# EAGLE schematic PowerMeter (EAGLE 7.2.0)
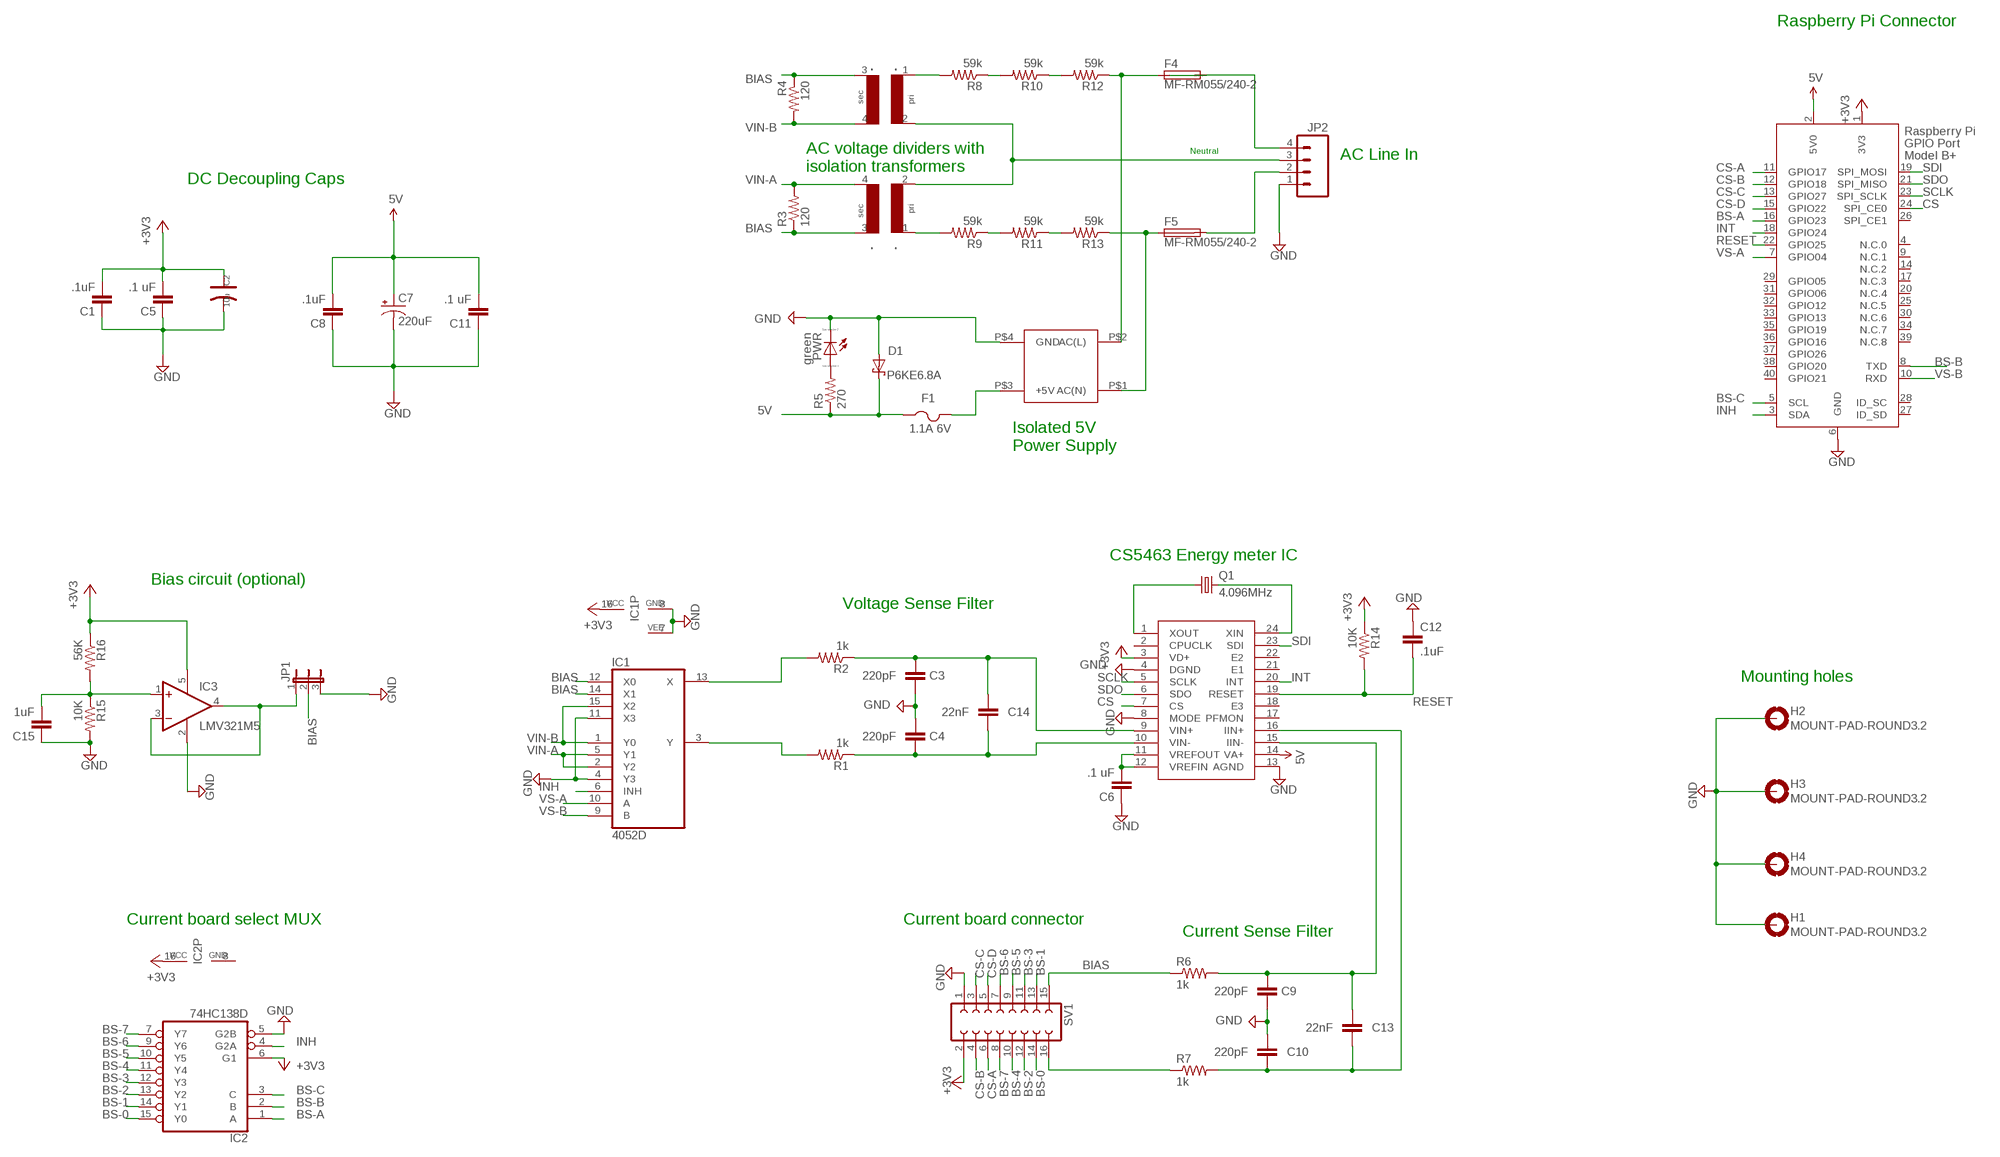
[diagram p0: schematic, sheet 1]

## Parts
C1  .1uF  C-EUC1206  [C1206]
C2  10u  CAP-AVX-C  [AVX-C]
C3  220pF  C-EUC1206  [C1206]
C4  220pF  C-EUC1206  [C1206]
C5  .1 uF  C-EUC1206  [C1206]
C6  .1 uF  C-EUC1206  [C1206]
C7  220uF  CPOL-USE2,5-6E  [E2,5-6E]
C8  .1uF  C-EUC1206  [C1206]
C9  220pF  C-EUC1206  [C1206]
C10  220pF  C-EUC1206  [C1206]
C11  .1 uF  C-EUC1206  [C1206]
C12  .1uF  C-EUC1206  [C1206]
C13  22nF  C-EUC1206  [C1206]
C14  22nF  C-EUC1206  [C1206]
C15  1uF  C-EUC1206  [C1206]
D1  P6KE6.8A  P6KEXXA  [C1702-15]
F1  1.1A 6V  PTCFUSE-1812  [1812]
F4  MF-RM055/240-2  FUSETE5  [TE5]
F5  MF-RM055/240-2  FUSETE5  [TE5]
H1  MOUNT-PAD-ROUND3.2  [3,2-PAD]
H2  MOUNT-PAD-ROUND3.2  [3,2-PAD]
H3  MOUNT-PAD-ROUND3.2  [3,2-PAD]
H4  MOUNT-PAD-ROUND3.2  [3,2-PAD]
IC1  4052D  [SO16]
IC2  74HC138D  [SO16]
IC3  LMV321M5  [SOT23-5]
JP1  JP2E  [JP2]
JP2  M04SCREW  [SCREWTERMINAL-3.5MM-4]
PWR  green  LED_E  [LED_1206]
Q1  4.096MHz  CRYSTALHC49S  [HC49/S]
R1  1k  R-US_R1206  [R1206]
R2  1k  R-US_R1206  [R1206]
R3  120  R-US_R1206  [R1206]
R4  120  R-US_R1206  [R1206]
R5  270  R-US_R1206  [R1206]
R6  1k  R-US_R1206  [R1206]
R7  1k  R-US_R1206  [R1206]
R8  59k  R-US_R1206  [R1206]
R9  59k  R-US_R1206  [R1206]
R10  59k  R-US_R1206  [R1206]
R11  59k  R-US_R1206  [R1206]
R12  59k  R-US_R1206  [R1206]
R13  59k  R-US_R1206  [R1206]
R14  10K  R-US_R1206  [R1206]
R15  10K  R-US_R1206  [R1206]
R16  56K  R-US_R1206  [R1206]
SV1  FE08-2  [FE08-2]
U$2  TV16E  [TV16E]
U$3  TV16E  [TV16E]
U$4  VSK-S10  [VSK-S10]
U$5  CS5463  [SSOP24]
X2  RASPI_BOARD_B+_E4  [RASPI_BOARD_B+_EDGES_4DRILL]

## Nets
5V: C7.+ C8.2 C11.2 D1.C F1.1 R5.1 U$5.14(VA+) X2.2(5V0)
+3V3: C1.2 C2.+ C5.2 IC1.16(VCC) IC2.6(G1) IC2.16(VCC) IC3.5(V+) R14.1 R16.1 SV1.2 U$5.3(VD+) X2.1(3V3)
+5V: F1.2 U$4.P$3(+5V)
AC1 [ac line]: R8.2 U$3.1
AC-A [ac line]: F4.1 R12.1 U$4.P$2(AC(L))
AC-B [ac line]: F5.1 R13.1 U$4.P$1(AC(N))
BIAS: IC1.12(X0) IC1.14(X1) JP1.2 R3.1 R4.1 R6.1 SV1.15 U$2.3 U$3.3
BS-0: IC2.15(Y0) SV1.14
BS-1: IC2.14(Y1) SV1.13
BS-2: IC2.13(Y2) SV1.12
BS-3: IC2.12(Y3) SV1.11
BS-4: IC2.11(Y4) SV1.10
BS-5: IC2.10(Y5) SV1.9
BS-6: IC2.9(Y6) SV1.7
BS-7: IC2.7(Y7) SV1.8
BS-A: IC2.1(A) X2.16(GPIO23)
BS-B: IC2.2(B) X2.8(TXD)
BS-C: IC2.3(C) X2.5(SCL)
C5: C10.1 C13.1 R7.2 U$5.16(IIN+)
CS: U$5.7(CS) X2.24(SPI_CE0)
CS-A: SV1.6 X2.11(GPIO17)
CS-B: SV1.4 X2.12(GPIO18)
CS-C: SV1.3 X2.13(GPIO27)
CS-D: SV1.5 X2.15(GPIO22)
GND: C1.1 C2.- C3.1 C4.2 C5.1 C6.1 C7.- C8.1 C9.1 C10.2 C11.1 C12.1 C15.1 D1.A H1.B3,2(MOUNT) H2.B3,2(MOUNT) H3.B3,2(MOUNT) H4.B3,2(MOUNT) IC1.4(Y3) IC1.7(VEE) IC1.8(GND) IC1.11(X3) IC2.5(G2B) IC3.2(V-) JP1.3 JP2.1 PWR.C R15.2 SV1.1 U$4.P$4(GND) U$5.4(DGND) U$5.8(MODE) U$5.13(AGND) X2.6(GND)
IIN: R7.1 SV1.16
INH: IC1.6(INH) IC2.4(G2A) X2.3(SDA)
INT: U$5.20(INT) X2.18(GPIO24)
N [ac line]: JP2.3 U$2.2 U$3.2
N$1: Q1.1 U$5.1(XOUT)
N$2: C15.2 IC3.1(+IN) R15.1 R16.2
N$7: PWR.A R5.2
N$8: C9.2 C13.2 R6.2 U$5.15(IIN-)
N$9 [ac line]: F4.2 JP2.4
N$10: IC3.3(-IN) IC3.4(OUT) JP1.1
N$12: Q1.2 U$5.24(XIN)
N$17: C6.2 U$5.11(VREFOUT) U$5.12(VREFIN)
N$23: IC1.13(X) R2.2
N$38 [ac line]: F5.2 JP2.2
N$39: IC1.3(Y) R1.2
N$43 [ac line]: R10.1 R12.2
N$44 [ac line]: R8.1 R10.2
N$46: C4.1 C14.1 R1.1 U$5.10(VIN-)
N$48 [ac line]: R11.1 R13.2
N$49 [ac line]: R9.1 R11.2
N$51 [ac line]: R9.2 U$2.1
R1: C3.2 C14.2 R2.1 U$5.9(VIN+)
RESET: C12.2 R14.2 U$5.19(RESET) X2.22(GPIO25)
SCLK: U$5.5(SCLK) X2.23(SPI_SCLK)
SDI: U$5.23(SDI) X2.19(SPI_MOSI)
SDO: U$5.6(SDO) X2.21(SPI_MISO)
VIN-A: IC1.2(Y2) IC1.5(Y1) R3.2 U$2.4
VIN-B: IC1.1(Y0) IC1.15(X2) R4.2 U$3.4
VS-A: IC1.10(A) X2.7(GPIO04)
VS-B: IC1.9(B) X2.10(RXD)
Unconnected: U$5.2(CPUCLK) U$5.17(PFMON) U$5.18(E3) U$5.21(E1) U$5.22(E2) X2.4(N.C.0) X2.9(N.C.1) X2.14(N.C.2) X2.17(N.C.3) X2.20(N.C.4) X2.25(N.C.5) X2.26(SPI_CE1) X2.27(ID_SD) X2.28(ID_SC) X2.29(GPIO05) X2.30(N.C.6) X2.31(GPIO06) X2.32(GPIO12) X2.33(GPIO13) X2.34(N.C.7) X2.35(GPIO19) X2.36(GPIO16) X2.37(GPIO26) X2.38(GPIO20) X2.39(N.C.8) X2.40(GPIO21)

## Notes on the sheet
- Raspberry Pi Connector
- Neutral
- AC Line In
- AC voltage dividers with
  isolation transformers
- DC Decoupling Caps
- Isolated 5V
  Power Supply
- CS5463 Energy meter IC
- Bias circuit (optional)
- Voltage Sense Filter
- Mounting holes
- Current board select MUX | Current board connector
- Current Sense Filter

## Power pins joined to a net without a drawn wire
GND: IC2.8(GND)

## Library data of the parts
C1 C3-C6 C8-C15 = rcl:C-EU: CAPACITOR, European symbol
C2 = Discrete:CAP*: Electrolytic Capacitors,Tantalum Capacitors and Super Capacitors
C7 = adafruit:CPOL-US: POLARIZED CAPACITOR, American symbol
D1 = diode:P6KEXXA: DIODE transient-voltage suppressor
F1 = adafruit:PTCFUSE: PTC fuses, resettable thermistors
F4 F5 = fuse:FUSE: Fuse; OC_FARNELL: unknown; OC_NEWARK: unknown
H1-H4 = holes:MOUNT-PAD-ROUND: MOUNTING PAD, round
IC1 = 40xx:4052: Dual 4-channel ANALOG MULTIPLEXER
IC2 = 74xx-eu:74*138: 3-line to 8-line DECODER/DEMULTIPLEXER
IC3 = linear:LMV321?*: General Purpose, Low Voltage, Rail-to-Rail Output Operational Amplifiers Source: http://www.national.com/mpf/LM/LMV321.html http://www.national.com/dt/lmv_qual.pdf
JP1 = jumper:JP2E: JUMPER
JP2 = SparkFun-Connectors:M04: Header 4 Standard 4-pin 0.1" header. Use with straight break away headers (SKU : PRT-00116), right angle break away headers (PRT-00553), swiss pins (PRT-00743), machine pins (PRT-00117), and female headers (PRT-00115). Molex polarized connector foot print use with SKU : PRT-08231 with associated crimp pins and housings. 1MM SMD Version SKU: PRT-10208
PWR = eagle-ltspice:LED_E: LED Source: http://www.osram.convergy.de Source: www.luxeon.com Source: www.kingbright.com; SPICEMODEL: NONE; SPICEPREFIX: D; SPICETYPE: diode
Q1 = crystal:CRYSTAL: CRYSTAL; OC_FARNELL: 1667008; OC_NEWARK: unknown
R1-R16 = resistor:R-US_: RESISTOR, American symbol
SV1 = con-lsta:FE08-2: FEMALE HEADER; OC_FARNELL: unknown; OC_NEWARK: unknown
U$2 U$3 = CraigJensen:TV16E: YHDC TV16E Transformer
U$4 = CraigJensen:VSK-S10
U$5 = Cirrus_Logic_By_element14_Batch_1:CS5463
X2 = raspberrypi_bastelstube_v13:RASPI_BOARD_B+: Raspberry Pi GPIO connector with markings for the outer dimensions of the Raspberry Pi board model B+ with different sets of drill holes or mounting pads

## Net classes
1 ac line: width 0.4 mm, clearance 1.2 mm